# Altium schematic sheet USB.SchDoc
size A
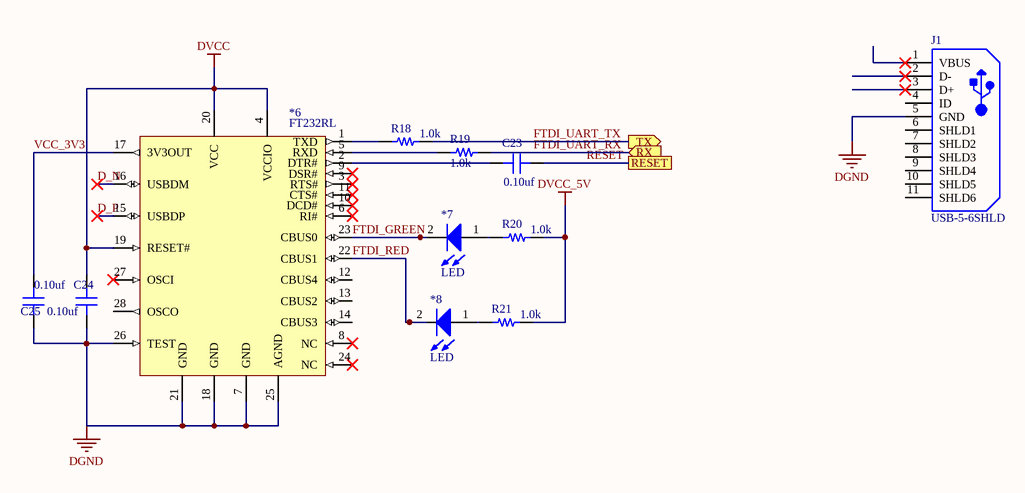
[diagram p0: USB.SchDoc]

## Parts
*6  FT232RL  [SSOP-28]
*7  LED  [0805_LED]
*8  LED  [0805_LED]
C23  value 0.10uf  [CAP 0603/1608]  (hidden comment: Capacitor MLCC 0.10uf 25V CAP 0603/1608)
C24  value 0.10uf  [CAP 0603/1608]  (hidden comment: Capacitor MLCC 0.10uf 25V CAP 0603/1608)
C25  value 0.10uf  [CAP 0603/1608]  (hidden comment: Capacitor MLCC 0.10uf 25V CAP 0603/1608)
J1  USB-5-6SHLD  [TECO-1981568-5_V]
R18  value 1.0k  [RES 0805/2012]  (hidden comment: Resistor 1.0k 0805 1/4W 1%)
R19  value 1.0k  [RES 0805/2012]  (hidden comment: Resistor 1.0k 0805 1/4W 1%)
R20  value 1.0k  [RES 0805/2012]  (hidden comment: Resistor 1.0k 0805 1/4W 1%)
R21  value 1.0k  [RES 0805/2012]  (hidden comment: Resistor 1.0k 0805 1/4W 1%)

## Ports
RESET, RX (in), TX (out)

## Nets
DGND: *6.7(GND) *6.18(GND) *6.21(GND) *6.25(AGND) *6.26(TEST) C24.1 C25.1 J1.5(GND)
DVCC: *6.4(VCCIO) *6.19(RESET#) *6.20(VCC) C24.2
DVCC_5V: R20.2 R21.2
D_N: *6.16(USBDM)
D_P: *6.15(USBDP)
FTDI_GREEN: *6.23(CBUS0) *7.2(K)
FTDI_RED: *6.22(CBUS1) *8.2(K)
FTDI_UART_RX: R19.2 ; port RX
FTDI_UART_TX: R18.2 ; port TX
RESET: C23.2 ; port RESET
VCC_3V3: *6.17(3V3OUT) C25.2
Net*6_1: *6.1(TXD) R18.1
Net*6_2: *6.2(DTR#) C23.1
Net*6_5: *6.5(RXD) R19.1
Net*7_1: *7.1(A) R20.1
Net*8_1: *8.1(A) R21.1

Not connected (* = marked no-connect by the designer): *6 3(RTS#)* 6(RI#)* 8(NC)* 9(DSR#)* 10(DCD#)* 11(CTS#)* 12(CBUS4) 13(CBUS2) 14(CBUS3) 24(NC)* 27(OSCI)* 28(OSCO); J1 1(VBUS)* 2(D-)* 3(D+)* 4(ID) 6(SHLD1) 7(SHLD2) 8(SHLD3) 9(SHLD4) 10(SHLD5) 11(SHLD6)

## Library data of the parts
*6 = 3: Manufacturer_id: 1; idIC_Interface: 3; Name: USB FTDI; Protocol: UART; Vin(Min): 3.3; Vin(Max): 5.25; Created_By: Kyle; Drawer_id: 1; MfrPartNo: FT232RL; Link: https://www.digikey.com/product-detail/en/ftdi-future-technology-devices-international-ltd/FT232RL-REEL/768-1007-1-ND/1836402
*7 = 2: Manufacturer_id: 1; idLED: 2; Name: LED_0805_GREEN; Value: Green; Brightness: 35mcd; Id: 20mA; Vf: 2V; Drawer_id: 1
*8 = 1: idLED: 1; Name: LED_0805_RED; Value: Red; Vf: 0.7V; Manufacturer_id: 1; Drawer_id: 1
C23-C25 = 583: Manufacturer_id: 1; idCapacitor: 583; Name: Cap_0.10uf_25V_CAP 0603/1608; Dielectric: Ceramic; Created_By: Nick Mah; Drawer_id: 1; Voltage_Rating: 25V; Package: CAP 0603/1608; Created_Date: 10/20/2018
J1 = 5: USB Micro Type B; Manufacturer_id: 1; MfrPartNo: 1981568-1; idConn: 5; Name: TE USB Micro; Value: CONN; Created_By: Aiku; Drawer_id: 1; Num_Contacts: 5; Link: https://www.mouser.com/ProductDetail/TE-Connectivity-AMP/1981568-1?qs=sGAEpiMZZMulM8LPOQ%252bykzEIUPbUCiSfqsfxH3Oq%252bYo%3d; ComponentLink1Description: Datasheet; Supplier1: TE; Created_Date: 10/20/2018
R18-R21 = 721: Manufacturer_id: 1; idResistor: 721; Name: Res_1.0k_0805_1/4W_1%; Created_By: Nick Mah; Supplier 1: Digi-Key; Drawer_id: 1; Tolerance: 1%; Power: 1/4W; Package: 0805; ComponentLink1Description: Datasheet; Created_Date: 2018-10-20